# Altium schematic sheet Dentist_camera_extender_schematic_sch_4.SchDoc
size A3; SheetNumber: 4; SheetTotal: 4
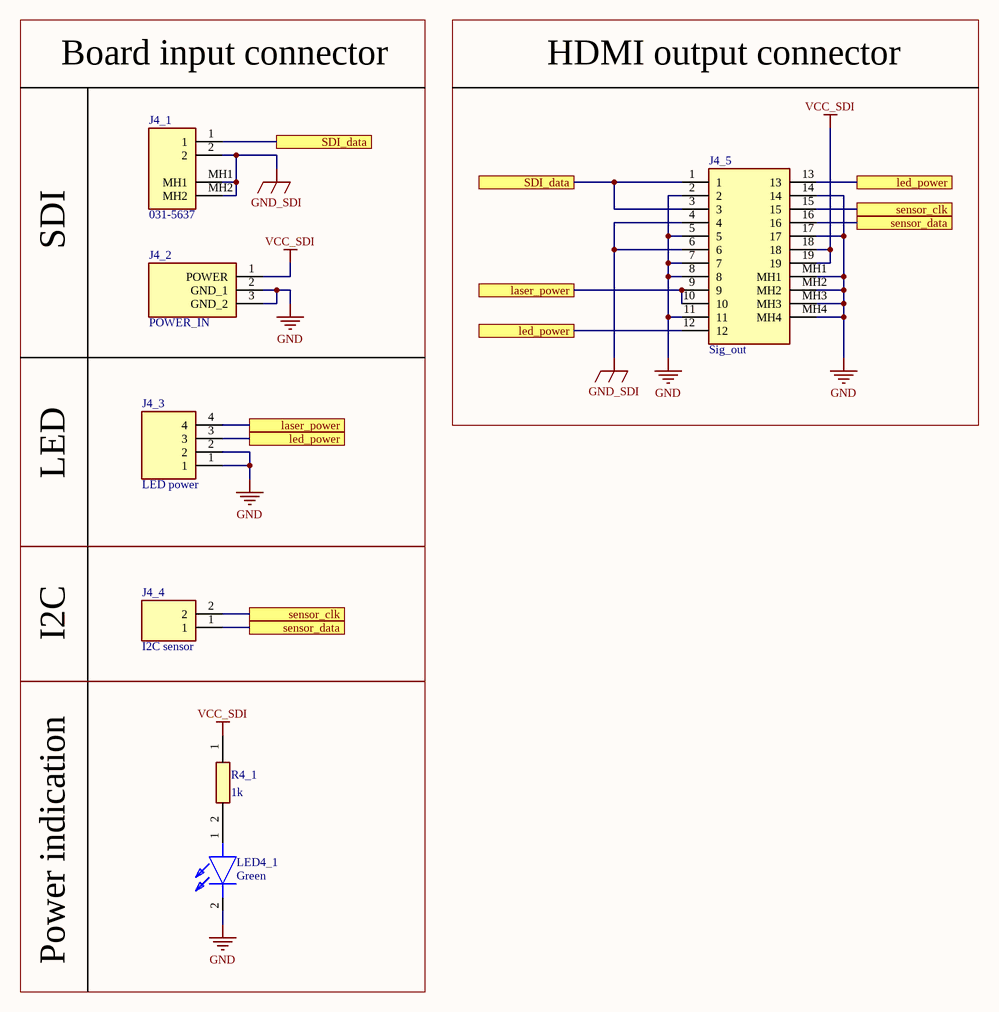
[diagram p0: Dentist_camera_extender_schematic_sch_4.SchDoc]

## Parts
J4_1  031-5637  [0315637]
J4_2  POWER_IN  [694106301002_1]
J4_3  LED power  [B04BJWPFSKRLFSN]
J4_4  I2C sensor  [B02BJWPFSKRLFSN]
J4_5  Sig_out  [10029449001RLF]
LED4_1  Green  [1721SYGCS530E2TR8]
R4_1  1k  [ERA6AEB1020V]

## Blocks framed on the sheet
HDMI output connector: J4_5
I2C: J4_4
Power indication: LED4_1 R4_1

## Ports
laser_power, led_power, SDI_data, sensor_clk, sensor_data

## Nets
GND: J4_2.2(GND_1) J4_2.3(GND_2) J4_3.1 J4_3.2 J4_5.2 J4_5.5 J4_5.7 J4_5.8 J4_5.11 J4_5.14 J4_5.17 J4_5.MH1 J4_5.MH2 J4_5.MH3 J4_5.MH4 LED4_1.2(K)
GND_SDI: J4_1.2 J4_1.MH1 J4_1.MH2 J4_5.4 J4_5.6
VCC_SDI: J4_2.1(POWER) J4_5.18 J4_5.19 R4_1.1
laser_power: J4_3.4 J4_5.9 J4_5.10 ; port laser_power
led_power: J4_3.3 J4_5.12 J4_5.13 ; port led_power
SDI_data: J4_1.1 J4_5.1 J4_5.3 ; port SDI_data
sensor_clk: J4_4.2 J4_5.15 ; port sensor_clk
sensor_data: J4_4.1 J4_5.16 ; port sensor_data
NetLED4_1_1: LED4_1.1(A) R4_1.2

## Notes on the sheet
- Board input connector
- SDI
- LED

## Library data of the parts
J4_1 = 031-5637: Connector; Manufacturer_Name: Amphenol; Datasheet Link: https://datasheet.datasheetarchive.com/originals/distributors/Datasheets-DGA15/760804.pdf; Manufacturer_Part_Number: 031-5637; Mouser Part Number: 523-31-5637; Mouser Price/Stock: https://www.mouser.co.uk/ProductDetail/Amphenol-RF/031-5637/?qs=%2FrA2Kvb8OYb4YSYQEIM5Nw%3D%3D; Arrow Part Number: 031-5637; Arrow Price/Stock: https://www.arrow.com/en/products/031-5637/amphenol-rf
J4_2 = 694106301002: Manufacturer_Name: Wurth Elektronik; Datasheet Link: https://datasheet.datasheetarchive.com/originals/distributors/Datasheets_SAMA/1c153bd2ba42bb51bda59ee4cd9765cd.pdf; Manufacturer_Part_Number: 694106301002; Mouser Part Number: 710-694106301002; Mouser Price/Stock: https://www.mouser.co.uk/ProductDetail/Wurth-Elektronik/694106301002?qs=a9WhcLg8qCwOEkcI62k5mA%3D%3D
J4_3 = B04B-JWPF-SK-R_LF__SN_: Connector; Manufacturer_Name: JST (JAPAN SOLDERLESS TERMINALS); Manufacturer_Part_Number: B04B-JWPF-SK-R(LF)(SN); Datasheet Link: https://componentsearchengine.com/Datasheets/2/B04B-JWPF-SK-R(LF)(SN).pdf; Height: 16.6mm
J4_4 = B02B-JWPF-SK-R_LF__SN_: Connector; Manufacturer_Name: JST (JAPAN SOLDERLESS TERMINALS); Manufacturer_Part_Number: B02B-JWPF-SK-R(LF)(SN); Datasheet Link: https://datasheet.datasheetarchive.com/originals/dk/DKDS-13/257039.pdf; Height: 16.6mm; Arrow Part Number: B02B-JWPF-SK-R(LF)(SN); Arrow Price/Stock: https://www.arrow.com/en/products/b02b-jwpf-sk-r-lf-sn/jst-manufacturing
J4_5 = 10029449-001RLF: Manufacturer_Name: Amphenol; Datasheet Link: https://cdn.amphenol-icc.com/media/wysiwyg/files/drawing/10029449.pdf; Height: 6.3mm; Manufacturer_Part_Number: 10029449-001RLF; Mouser Part Number: 649-10029449-001RLF; Mouser Price/Stock: https://www.mouser.co.uk/ProductDetail/Amphenol-FCI/10029449-001RLF?qs=D%252By4jQJzx8L60NhBOOKSqQ%3D%3D; Arrow Part Number: 10029449-001RLF; Arrow Price/Stock: https://www.arrow.com/en/products/10029449-001rlf/amphenol-fci?region=nac
LED4_1 = 17-21SYGC_S530-E2_TR8: LED; Manufacturer_Name: Everlight; Manufacturer_Part_Number: 17-21SYGC/S530-E2/TR8; Datasheet Link: https://media.digikey.com/pdf/Data%20Sheets/Everlight%20PDFs/17-21SYGC,S530-E2,TR8.pdf; Height: 1.1mm; Mouser Part Number: 638-1721SYGCS530E2; Mouser Price/Stock: https://www.mouser.co.uk/ProductDetail/Everlight/17-21SYGC-S530-E2-TR8?qs=8PzhAHr7IdMM%252BF4DSbsAKQ%3D%3D; Arrow Part Number: 17-21SYGC/S530-E2/TR8; Arrow Price/Stock: https://www.arrow.com/en/products/17-21sygcs530-e2tr8/everlight-electronics?region=nac
R4_1 = ERA6ARB103V: Manufacturer_Name: Panasonic; Datasheet Link: https://industrial.panasonic.com/cdbs/www-data/pdf/RDM0000/AOA0000C307.pdf; Height: 0.6mm; Manufacturer_Part_Number: ERA6ARB103V; Arrow Part Number: ERA6ARB103V; Arrow Price/Stock: https://www.arrow.com/en/products/era-6arb103v/panasonic